# EAGLE design ffc-breakout_v1.1 (EAGLE 8.4.0)
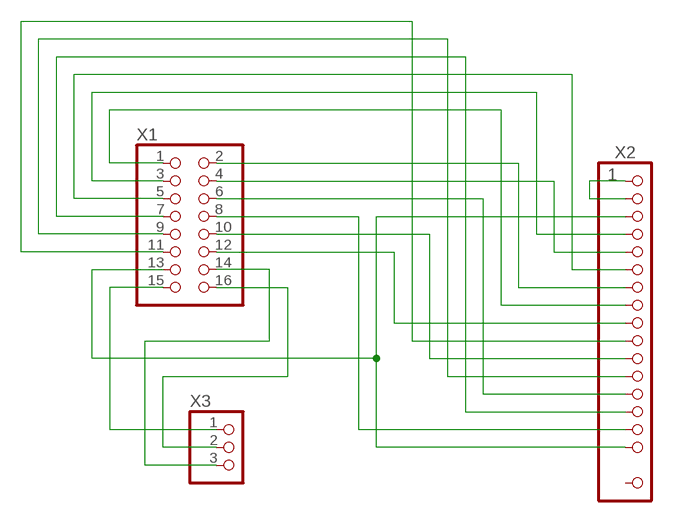
[diagram p0: schematic, sheet 1]

## Parts
X1  PINHD-2X8  [2X08]
X2  AMP_SFW16R-2STE1LF  [AMP_SFW16R-2STE1LF]
X3  PINHD-1X3/90  [1X03/90]

## Nets
N$1: X1.16 X3.2
N$2: X1.15 X3.1
N$3: X1.13 X2.P$3 X2.P$16
N$4: X1.14 X3.3
N$5: X2.P$1 X2.P$2
N$6: X1.1 X2.P$8
N$7: X1.2 X2.P$7
N$8: X1.3 X2.P$4
N$9: X1.4 X2.P$5
N$10: X1.5 X2.P$6
N$11: X1.6 X2.P$13
N$12: X1.7 X2.P$14
N$13: X1.8 X2.P$15
N$14: X1.9 X2.P$12
N$15: X1.10 X2.P$11
N$16: X1.11 X2.P$10
N$17: X1.12 X2.P$9
Unconnected: X2.PAD1 X2.PAD2

## Library data of the parts
X1 = pinhead:PINHD-2X8: PIN HEADER
X2 = components:AMP_SFW16R-2STE1LF
X3 = pinhead:PINHD-1X3: PIN HEADER

## Net classes
0 default: width 0.406 mm, drill 0.406 mm, clearance 0.203 mm

## Board
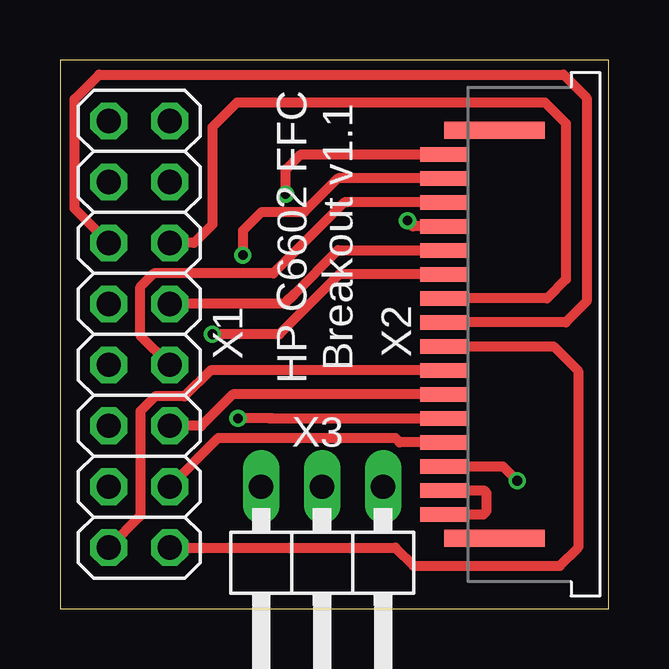
[diagram p1: board, top side]
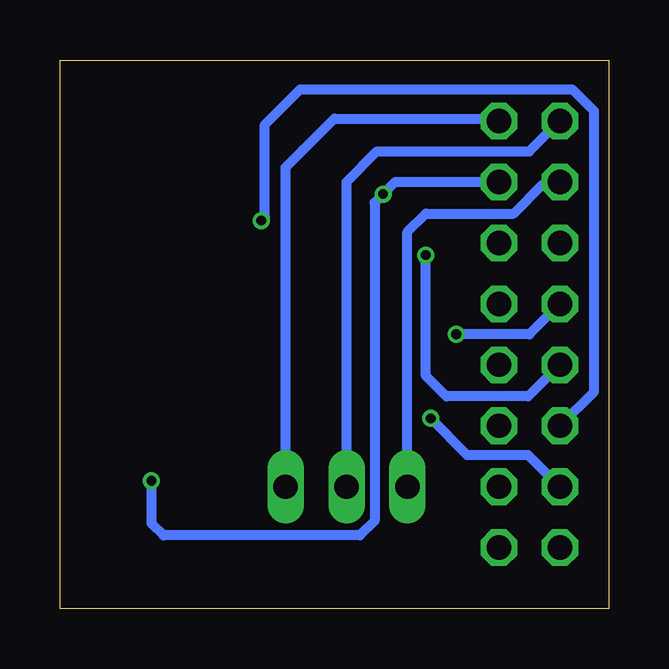
[diagram p2: board, bottom side, seen from below]

Size 22.86 x 22.86 mm. Coordinates in mm from the lower left corner, seen from the top.
Outline: 0,0 22.86,0 22.86,22.86 0,22.86 0,0
Copper layers (1*16): Top 0.035mm / dielectric 1.5mm / Bottom 0.035mm
Design rules "DirtyPCBs-2layer": minimum track width 5mil, minimum drill 12mil, track to track 5mil, track to pad 5mil, pad to pad 5mil, via to via 5mil, smd to smd 0mil, copper to edge 10mil, drill to drill 10mil, minimum pad ring 10mil, minimum via ring 6mil, stop-mask expansion 2mil, vias tented up to drill 25mil, thermal gap 10mil

### Footprints (pad centres in the part's own frame; a part is rotated, then mirrored left to right if it is on the bottom)
2X08 = drill 1.016 octagon: 1 -8.89,-1.27; 2 -8.89,1.27; 3 -6.35,-1.27; 4 -6.35,1.27; 5 -3.81,-1.27; 6 -3.81,1.27; 7 -1.27,-1.27; 8 -1.27,1.27; 9 1.27,-1.27; 10 1.27,1.27; 11 3.81,-1.27; 12 3.81,1.27; 13 6.35,-1.27; 14 6.35,1.27; 15 8.89,-1.27; 16 8.89,1.27
AMP_SFW16R-2STE1LF = smd 0.6 x 2: P$1 -7.5,0; P$2 -6.5,0; P$3 -5.5,0; P$4 -4.5,0; P$5 -3.5,0; P$6 -2.5,0; P$7 -1.5,0; P$8 -0.5,0; P$9 0.5,0; P$10 1.5,0; P$11 2.5,0; P$12 3.5,0; P$13 4.5,0; P$14 5.5,0; P$15 6.5,0; P$16 7.5,0 | smd 0.7 x 4.2: PAD1 -8.5,-2.1; PAD2 8.5,-2.1
1X03/90 = drill 1.016 long: 1 -2.54,-3.81; 2 0,-3.81; 3 2.54,-3.81

### Placement (x,y rotation side)
X1  3.3,11.43 90 top
X2  16,11.43 90 top
X3  10.92,1.27 180 top

### Tracks (layer width: path | path; a pad name or v marks a point on that pad's centre or on a via)
N$1
  Bottom 0.406: X3.2 10.92,17.78 9.65,19.05 3.3,19.05 X1.16
N$2
  Bottom 0.406: 12.75,19.1 13.41,18.44 | 12.75,19.1 11.43,20.42 4.57,20.42 X1.15 | X3.1 13.46,18.39 12.75,19.1
N$3  (via drill 0.41)
  Top 0.406: X2.P$3 18.45,5.93 v19.05,5.33 | v9.4,17.27 9.4,18.29 10.04,18.93 X2.P$16
  Bottom 0.406: v19.05,5.33 19.05,3.56 18.54,3.05 10.36,3.05 9.75,3.66 9.75,16.92 v9.4,17.27 8.89,17.78 X1.13
N$4
  Bottom 0.406: X1.14 2.13,17.68 2.74,17.68 3.96,16.46 7.62,16.46 8.38,15.7 X3.3
N$5
  Top 0.406: X2.P$2 17.68,4.93 17.78,4.83 17.78,4.06 17.65,3.93 X2.P$1
N$6
  Top 0.406: X1.1 13.97,2.54 14.73,1.78 20.83,1.78 21.59,2.54 21.59,9.91 20.57,10.93 X2.P$8
N$7
  Top 0.406: X1.2 3.35,3.86 3.35,8.23 3.96,8.84 5.18,8.84 6.27,9.93 X2.P$7
N$8
  Top 0.406: X2.P$4 14.15,6.93 13.97,7.11 6.6,7.11 X1.3
N$9  (via drill 0.41)
  Top 0.406: 8.74,7.92 8.89,7.92 | 8.89,7.92 15.85,7.92 X2.P$5 | 8.89,7.92 v7.42,7.92
  Bottom 0.406: X1.4 3.35,6.4 5.89,6.4 v7.42,7.92
N$10
  Top 0.406: X1.5 5.89,7.62 7.2,8.93 X2.P$6
N$11  (via drill 0.41)
  Top 0.406: X2.P$13 14.72,15.93 v14.48,16.17
  Bottom 0.406: X1.6 0.61,9.04 0.61,20.73 1.52,21.64 12.85,21.64 14.33,20.17 14.33,16.32 v14.48,16.17
N$12
  Top 0.406: X2.P$14 11.85,16.93 8.89,13.97 3.91,13.97 3.35,13.41 3.35,11.38 X1.7
N$13  (via drill 0.41)
  Top 0.406: X2.P$15 11.58,17.93 10.16,16.51 8.38,16.51 7.62,15.75 v7.62,14.73
  Bottom 0.406: X1.8 3.35,8.84 6.76,8.84 7.62,9.7 v7.62,14.73
N$14
  Top 0.406: 9.45,12.8 9.75,13.11 | 9.75,13.11 11.58,14.94 15.85,14.94 X2.P$12 | 9.75,13.11 9.35,12.7 X1.9
N$15  (via drill 0.41)
  Top 0.406: X2.P$11 11.64,13.93 9.14,11.43 v6.35,11.43
  Bottom 0.406: X1.10 3.3,11.43 v6.35,11.43
N$16
  Top 0.406: X2.P$10 20.3,12.93 21.08,13.72 21.08,20.22 20.22,21.08 7.37,21.08 6.35,20.07 6.35,16 5.59,15.24 X1.11
N$17
  Top 0.406: X2.P$9 21.07,11.93 21.95,12.8 21.95,21.29 20.98,22.25 1.63,22.25 0.61,21.23 0.61,16.66 X1.12

### Text on the board
tPlace: HP C6602 FFC / Breakout v1.1